# EAGLE design oscyloskop-0v2 (EAGLE 9.6.2)
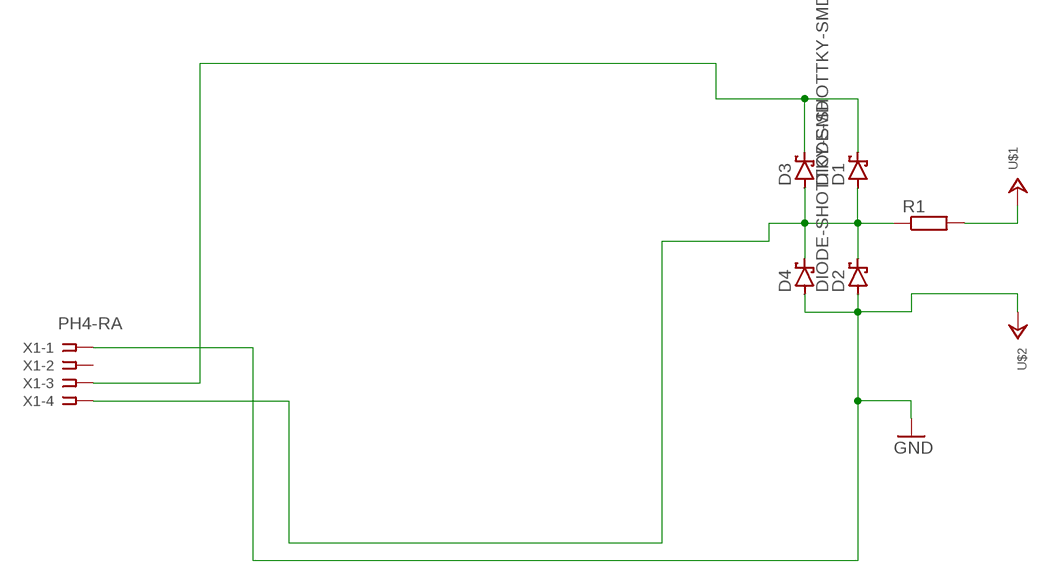
[diagram p0: schematic, sheet 1]

## Parts
D1  DIODE-SHOTTKY-THT  [DO41-7.6]
D2  DIODE-SHOTTKY-THT  [DO41-7.6]
D3  DIODE-SHOTTKY-SMD  [SOD123]
D4  DIODE-SHOTTKY-SMD  [SOD123]
R1  R0204/7  [0204/7]
U$1  CON-BANANA  [BANANA]
U$2  CON-BANANA  [BANANA]
X1  PH4-RA  [SSW-104-02-G-S-RA]

## Nets
GND: D2.A D4.A U$2.P$1(IO) X1.1
N$1: D1.C D3.C X1.3
N$2: D1.A D2.C D3.A D4.C R1.1 X1.4
N$5: R1.2 U$1.P$1(IO)
Unconnected: X1.2

## Library data of the parts
D1-D4 = common:DIODE-SHOTTKY: 1.0A SCHOTTKY BARRIER RECTIFIER Source: http://www.diodes.com/datasheets/ds23001.pdf
R1 = common:R: RESISTOR, European symbol; SPICEPREFIX: R
U$1 U$2 = common:CON-BANANA
X1 = common:PH4: THROUGH-HOLE .025" SQ POST SOCKET Source: Samtec SSW.pdf; MF: Samtec Inc.; MPN: SSW-104-02-G-S-RA; OC_FARNELL: unknown; OC_NEWARK: 11P9385

## Board
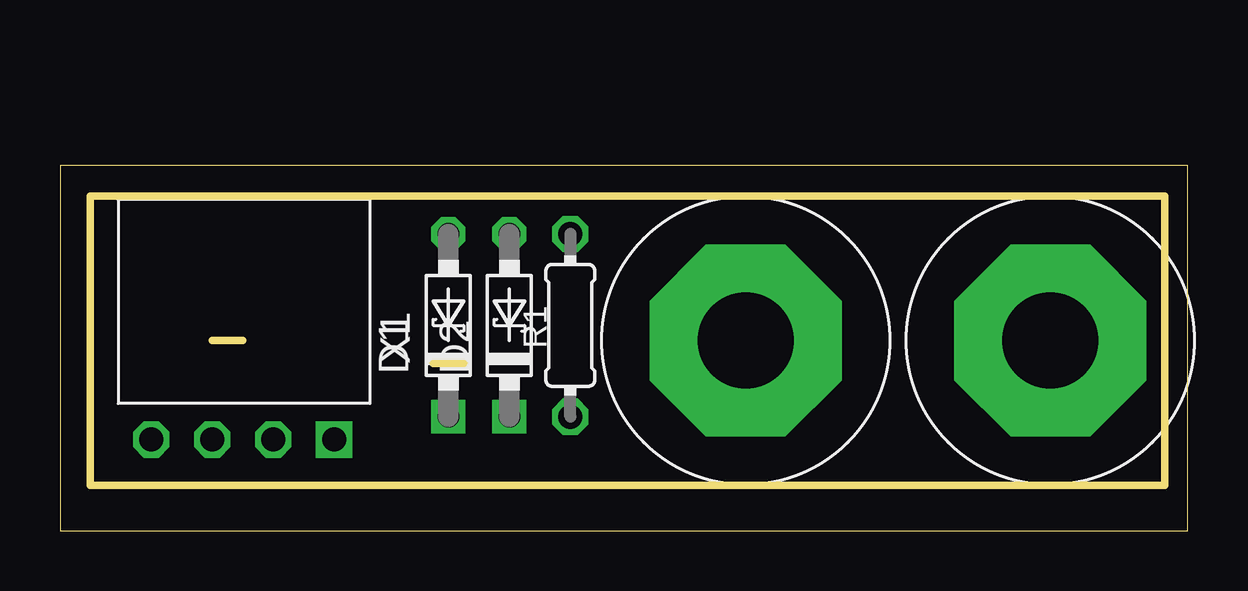
[diagram p1: board, top side]
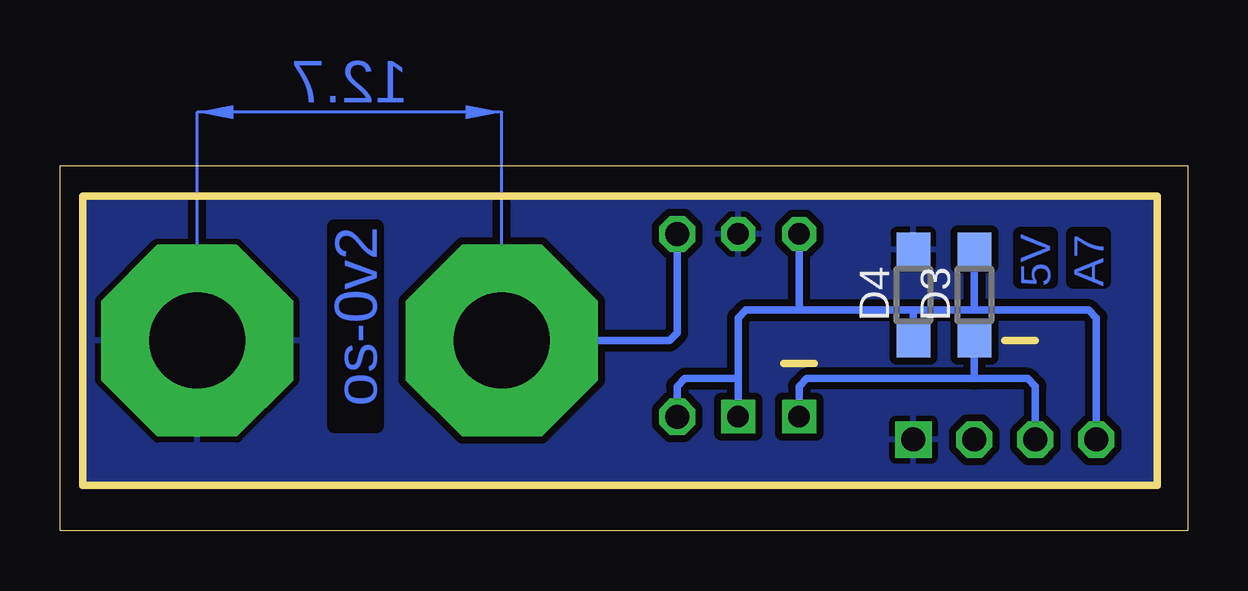
[diagram p2: board, bottom side, seen from below]

Size 46.98 x 15.23 mm. Coordinates in mm from the lower left corner, seen from the top.
Outline: 46.98,0 46.98,15.23 0,15.23 0,0 46.98,0
Copper layers (1*16): Top 0.035mm / dielectric 1.5mm / Bottom 0.035mm
Design rules "default": minimum track width 6mil, minimum drill 0.35mm, track to track 6mil, track to pad 6mil, pad to pad 6mil, via to via 6mil, smd to smd 6mil, copper to edge 40mil, drill to drill 6mil, minimum pad ring 10mil, minimum via ring 8mil, stop-mask expansion 4mil, vias tented up to drill 0mil, thermal gap 10mil
Milling: 6 lines

### Footprints (pad centres in the part's own frame; a part is rotated, then mirrored left to right if it is on the bottom)
DO41-7.6 = drill 0.9 octagon: A 3.81,0 | drill 0.9 square: C -3.81,0
SOD123 = smd 1.4 x 1.4: A 1.9,0; C -1.9,0
0204/7 = drill 1 octagon: 1 -3.81,0; 2 3.81,0
BANANA = drill 4 pad 8 octagon: P$1 0,0
SSW-104-02-G-S-RA = drill 1 square: 1 0,0 | drill 1 octagon: 2 2.54,0; 3 5.08,0; 4 7.62,0

### Placement (x,y rotation side)
D1  16.18,8.57 90 top
D2  18.72,8.57 90 top
D3  8.88,9.84 90 bottom
D4  11.42,9.84 90 bottom
R1  21.26,8.57 90 top
U$1  28.57,7.94 90 top
U$2  41.27,7.94 90 top
X1  11.42,3.81 180 top

### Tracks (layer width: path | path; a pad name or v marks a point on that pad's centre or on a via)
GND
  pour Bottom (isolate 0.305): 46.03,1.91 1.26,1.91 1.26,13.97 46.03,13.97
N$1
  Bottom 0.305: X1.3 6.34,6.03 6.66,6.35 8.88,6.35 | 8.88,6.35 15.87,6.35 16.18,6.03 D1.C | D3.C 8.88,6.35
N$2
  Bottom 0.305: R1.1 21.26,6.03 20.95,6.35 18.72,6.35 | D2.C 18.72,6.35 | 18.72,6.35 18.72,8.89 18.41,9.21 16.18,9.21 | 16.18,9.21 D1.A | 16.18,9.21 11.42,9.21 | 11.42,9.21 8.88,9.21 | 8.88,9.21 4.12,9.21 3.8,8.89 X1.4 | D3.A 8.88,9.21 | 11.42,9.21 D4.C
N$5
  Bottom 0.305: U$1.P$1 21.58,7.94 21.26,8.25 R1.2
(copper drawn outside any net)
  shapes: Bottom area x1

### Text on the board
Bottom: os-0v2 | A7 | 5V